# EAGLE design Agena (EAGLE 9.6.2)
AUTHOR: COREY AGENA; BOARD_NAME: OVEN CONTROLLER; DOC_NUM: 1; PROJECT_NAME: HW0; REVISION: 1
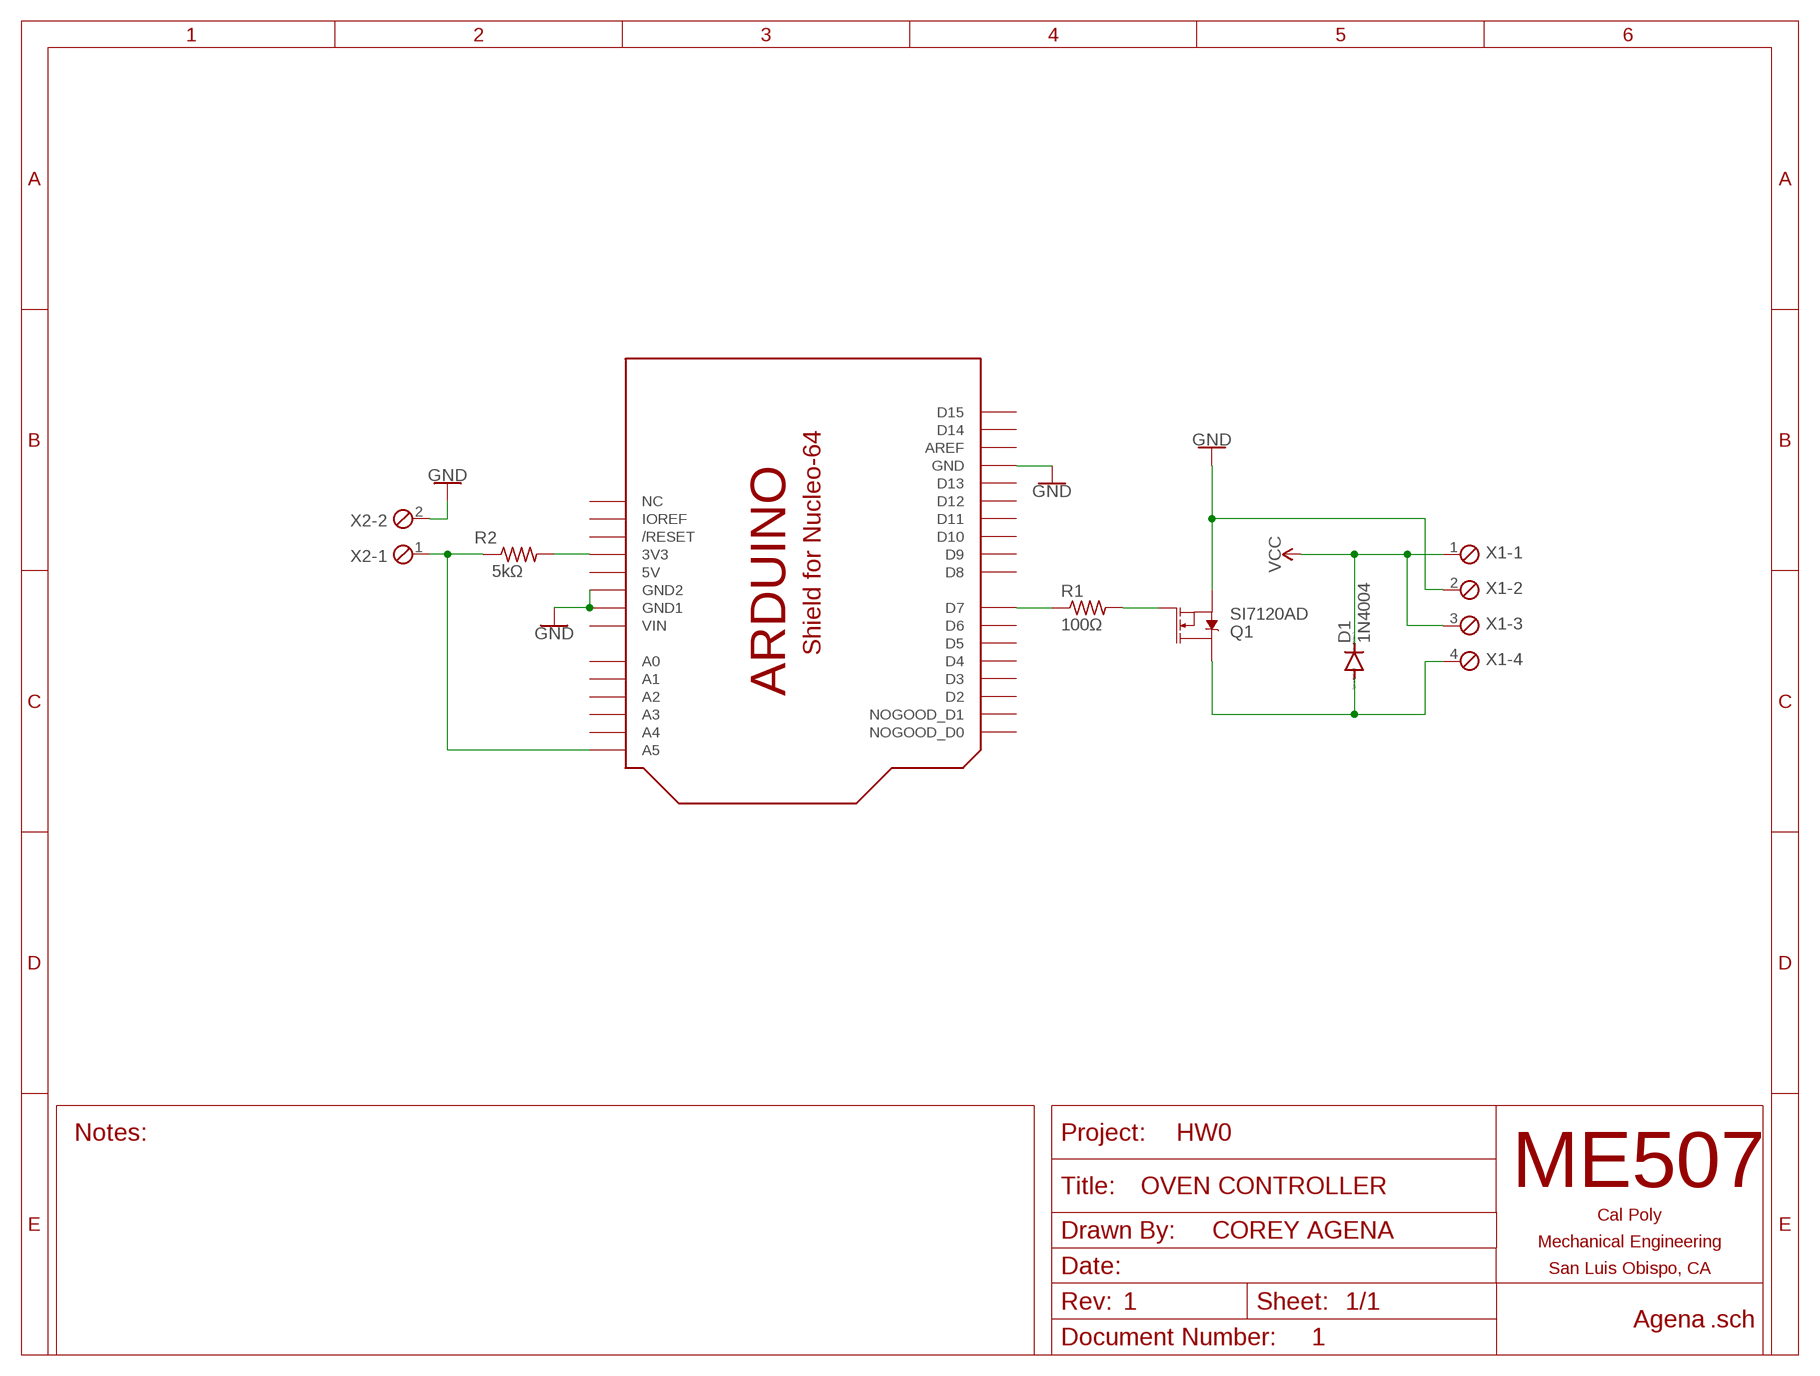
[diagram p0: schematic, sheet 1]

## Parts
D1  1N4004  [DO41-10]
Q1  SI7120AD  [1212-8]
R1  100Ω  R-US_R0805  [R0805]
R2  5kΩ  R-US_M0805  [M0805]
U$1  SHIELD_FOR_NUCLE0_64_SHORT  [SHIELD_FOR_NUCLEO_64_SHORT]
X1  SCREWTERM_4P_381  [4POL381]
X2  SCREWTERM_2P_254  [2POL254]

## Nets
GND: Q1.1(S) Q1.2(S) Q1.3(S) U$1.GND U$1.GND1 U$1.GND2 X1.2 X2.2
N$1: R1.1 U$1.D7
N$2: Q1.4(G) R1.2
N$3: D1.A Q1.5(D) Q1.6(D) Q1.7(D) Q1.8(D) Q1.PAD(D) X1.4
N$4: R2.2 U$1.3V(3V3)
N$5: R2.1 U$1.A5 X2.1
VCC: D1.C X1.1 X1.3
Unconnected: U$1.A0 U$1.A1 U$1.A2 U$1.A3 U$1.A4 U$1.AREF U$1.D0(NOGOOD_D0) U$1.D1(NOGOOD_D1) U$1.D2 U$1.D3 U$1.D4 U$1.D5 U$1.D6 U$1.D8 U$1.D9 U$1.D10 U$1.D11 U$1.D12 U$1.D13 U$1.D14 U$1.D15 U$1.IOREF U$1.NC U$1.NRST(/RESET)

## Power pins joined to a net without a drawn wire
5V: U$1.5V
VIN: U$1.VIN

## Library data of the parts
D1 = diode:1N4004: DIODE general purpose rectifier, 1 A
Q1 = SparkFun-DiscreteSemi:SI7120AD: N-Channel 60 V (D-S) MOSFET; PROD_ID: TRAN-15814
R1 R2 = rcl:R-US_: RESISTOR, American symbol; SPICEPREFIX: R
U$1 = ME507:SHIELD_FOR_NUCLE0_64: Arduino Style Shield for Nucleo-64 This is a board outline with pin locations for an Arduino style shield which fits on top of an STM32 Nucleo-64. Pin names are generic except for Nucleo specific pins such as IOREF. There are two board sizes, the standard which matches the size of an Arduino Uno, and the short version which can be less expensive to produce if you don't need a lot of board area. The outline is on the DIMENSION layer. When making a new board, you must delete the lines which form the default board outline so that this package's outlines control the dimensions of the board. Pins D0 and D1 are connected to a communications port and are not available for general use, so they are labeled as NOGOOD on the symbol and footprints.
X1 = ME507:SCREWTERM_4P: Screw Terminal Block This part is designed for a screw terminal connector. The 2.54mm (0.100 inch) foorprint can also be used for male or female pin headers such as those on most development boards. One can also solder wires directly into the holes, though this makes modifications or repairs to the system more inconvenient. Larger versions can carry more current.
X2 = ME507:SCREWTERM_2P: Screw Terminal Block This part is designed for a screw terminal connector. The 2.54mm (0.100 inch) foorprint can also be used for male or female pin headers such as those on most development boards. One can also solder wires directly into the holes, though this makes modifications or repairs to the system more inconvenient. Larger versions can carry more current.

## Board
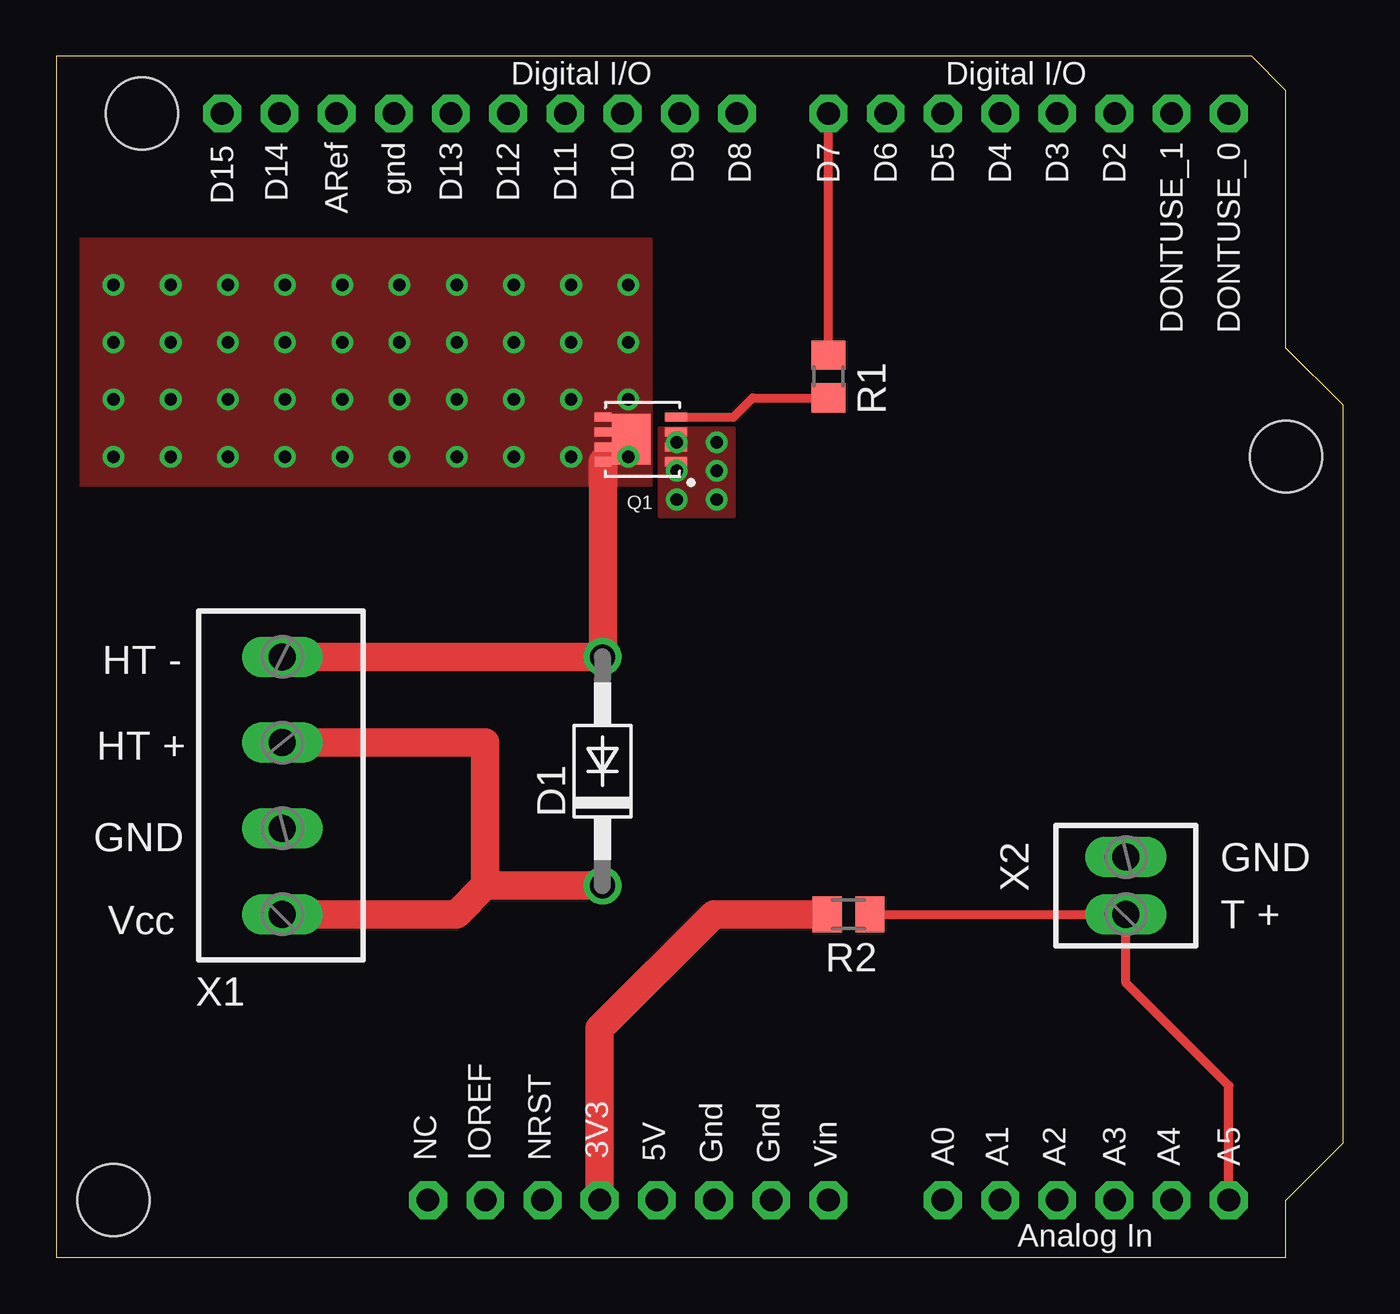
[diagram p1: board, top side]
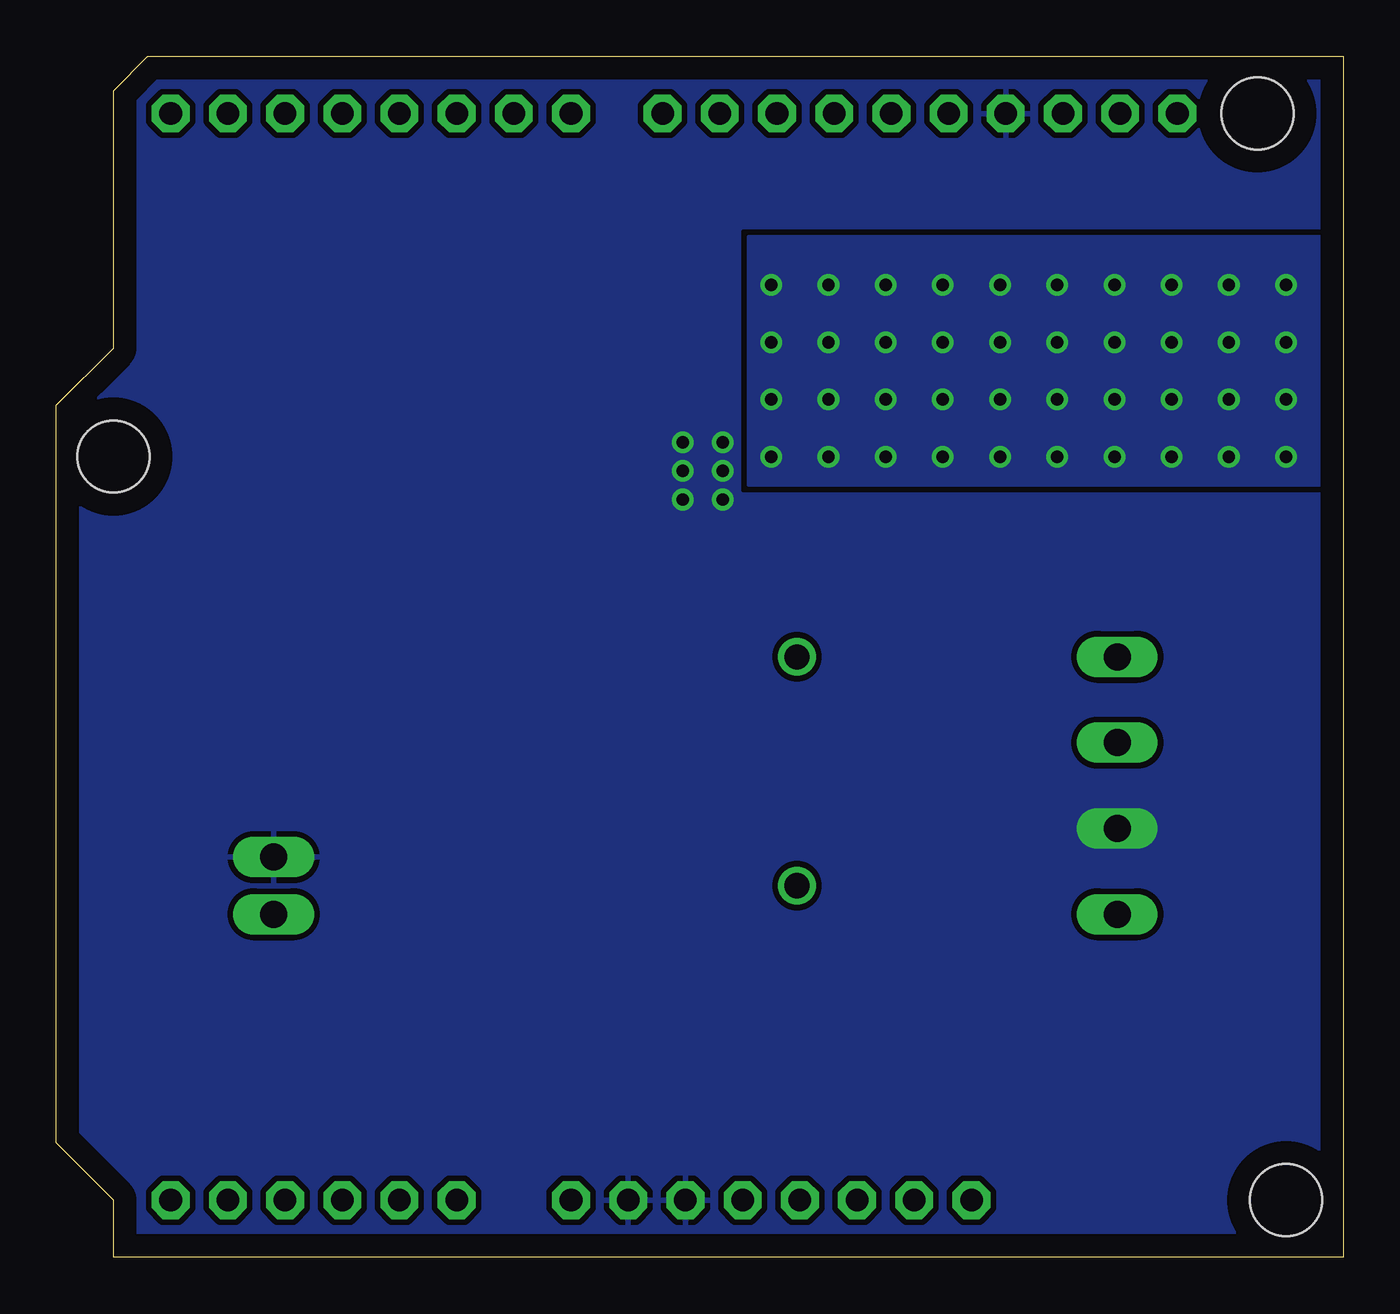
[diagram p2: board, bottom side, seen from below]

Size 57.15 x 53.34 mm. Coordinates in mm from the lower left corner, seen from the top.
Copper layers (1*16): Top 0.035mm / dielectric 1.5mm / Bottom 0.035mm
Design rules "default": minimum track width 6mil, minimum drill 0.35mm, track to track 6mil, track to pad 6mil, pad to pad 6mil, via to via 6mil, smd to smd 6mil, copper to edge 40mil, drill to drill 6mil, minimum pad ring 10mil, minimum via ring 8mil, stop-mask expansion 4mil, vias tented up to drill 0mil, thermal gap 10mil

### Footprints (pad centres in the part's own frame; a part is rotated, then mirrored left to right if it is on the bottom)
DO41-10 = drill 1.118: A 5.08,0; C -5.08,0
1212-8 = smd 0.99 x 0.405: 1 -1.49,0.99; 2 -1.49,0.33; 3 -1.49,-0.33; 4 -1.49,-0.99 | smd 0.76 x 0.405: 5 1.748,-0.99; 6 1.748,-0.33; 7 1.748,0.33; 8 1.748,0.99 | smd 1.725 x 2.235: PAD 0.502,0
R0805 = smd 1.3 x 1.5: 1 -0.95,0; 2 0.95,0
M0805 = smd 1.3 x 1.6: 1 -0.95,0; 2 0.95,0
SHIELD_FOR_NUCLEO_64_SHORT = drill 1 pad 1.676 octagon: 3V 35.56,2.54; 5V 38.1,2.54; A0 50.8,2.54; A1 53.34,2.54; A2 55.88,2.54; A3 58.42,2.54; A4 60.96,2.54; A5 63.5,2.54; AREF 23.876,50.8; D0 63.5,50.8; D1 60.96,50.8; D2 58.42,50.8; D3 55.88,50.8; D4 53.34,50.8; D5 50.8,50.8; D6 48.26,50.8; D7 45.72,50.8; D8 41.656,50.8; D9 39.116,50.8; D10 36.576,50.8; D11 34.036,50.8; D12 31.496,50.8; D13 28.956,50.8; D14 21.336,50.8; D15 18.796,50.8; GND 26.416,50.8; GND1 43.18,2.54; GND2 40.64,2.54; IOREF 30.48,2.54; NC 27.94,2.54; NRST 33.02,2.54; VIN 45.72,2.54 | hole 3.2: 15.24,50.8; 66.04,35.56; 13.97,2.54
4POL381 = drill 1.2 long: 1 -5.715,0; 2 -1.905,0; 3 1.905,0; 4 5.715,0
2POL254 = drill 1.2 long: 1 -1.27,0; 2 1.27,0

### Placement (x,y rotation side)
D1  24.26,21.59 90 top
Q1  26.04,36.32 180 top
R1  34.29,39.12 270 top
R2  35.18,15.24 180 top
U$1  -11.43,0 0 top
X1  10.03,20.95 90 top
X2  47.5,16.51 90 top

### Tracks (layer width: path | path; a pad name or v marks a point on that pad's centre or on a via)
GND  (via drill 0.55)
  other vias: 27.56,36.2 27.56,34.92 27.56,33.66 29.34,36.2 29.34,34.92 29.34,33.66
  pour Bottom (isolate 0.254, rank 2): 0,53.34 53.34,53.34 54.61,52.07 54.61,40.64 57.15,38.1 57.15,5.08 54.61,2.54 54.61,0 0,0
  pour Top (no thermals): 26.8,36.83 30.1,36.83 30.1,32.89 26.8,32.89
  pour Bottom (no thermals): 13.97,20.32 6.35,20.32 6.35,17.78 13.97,17.78
N$1
  Top 0.406: R1.1 U$1.D7
N$2
  Top 0.406: Q1.4 30.06,37.31 30.92,38.17 R1.2
N$3  (via drill 0.55)
  Top 1.27: X1.4 D1.A 24.29,26.7 Q1.8
  other vias: 2.54,43.18 2.54,40.64 2.54,38.1 2.54,35.56 5.08,43.18 5.08,40.64 5.08,38.1 5.08,35.56 7.62,43.18 10.16,43.18 12.7,43.18 15.24,43.18 17.78,43.18 20.32,43.18 22.86,43.18 25.4,43.18 7.62,40.64 10.16,40.64 12.7,40.64 15.24,40.64 17.78,40.64 20.32,40.64 22.86,40.64 22.86,38.1 20.32,38.1 17.78,38.1 15.24,38.1 12.7,38.1 10.16,38.1 7.62,38.1 7.62,35.56 10.16,35.56 12.7,35.56 15.24,35.56 17.78,35.56 20.32,35.56 22.86,35.56 25.4,40.64 25.4,38.1 25.4,35.56
  pour Top (no thermals): 26.29,38.1 26.29,34.29 23.62,34.29 23.62,37.97 23.62,38.1
  pour Top (no thermals): 26.42,34.29 26.42,45.21 1.02,45.21 1.02,34.29
  pour Bottom (isolate 0.254): 1.02,45.34 26.42,45.34 26.42,34.29 1.02,34.29
N$4
  Top 1.27: U$1.3V 24.13,10.16 29.21,15.24 R2.2
N$5
  Top 0.406: R2.1 X2.1 47.5,12.19 52.07,7.62 U$1.A5
VCC
  Top 1.27: X1.1 17.78,15.24 19.05,16.51 | 19.05,16.51 D1.C | 19.05,16.51 19.05,22.86 X1.3

### Text on the board
tNames: HT - | HT + | GND | GND | T + | Vcc